# Altium project Wireless_Security_Board.PrjPcb (part 3 of 4)

## Sheet Microcontrollers.SchDoc
size A3; SheetNumber: 3; SheetTotal: 4
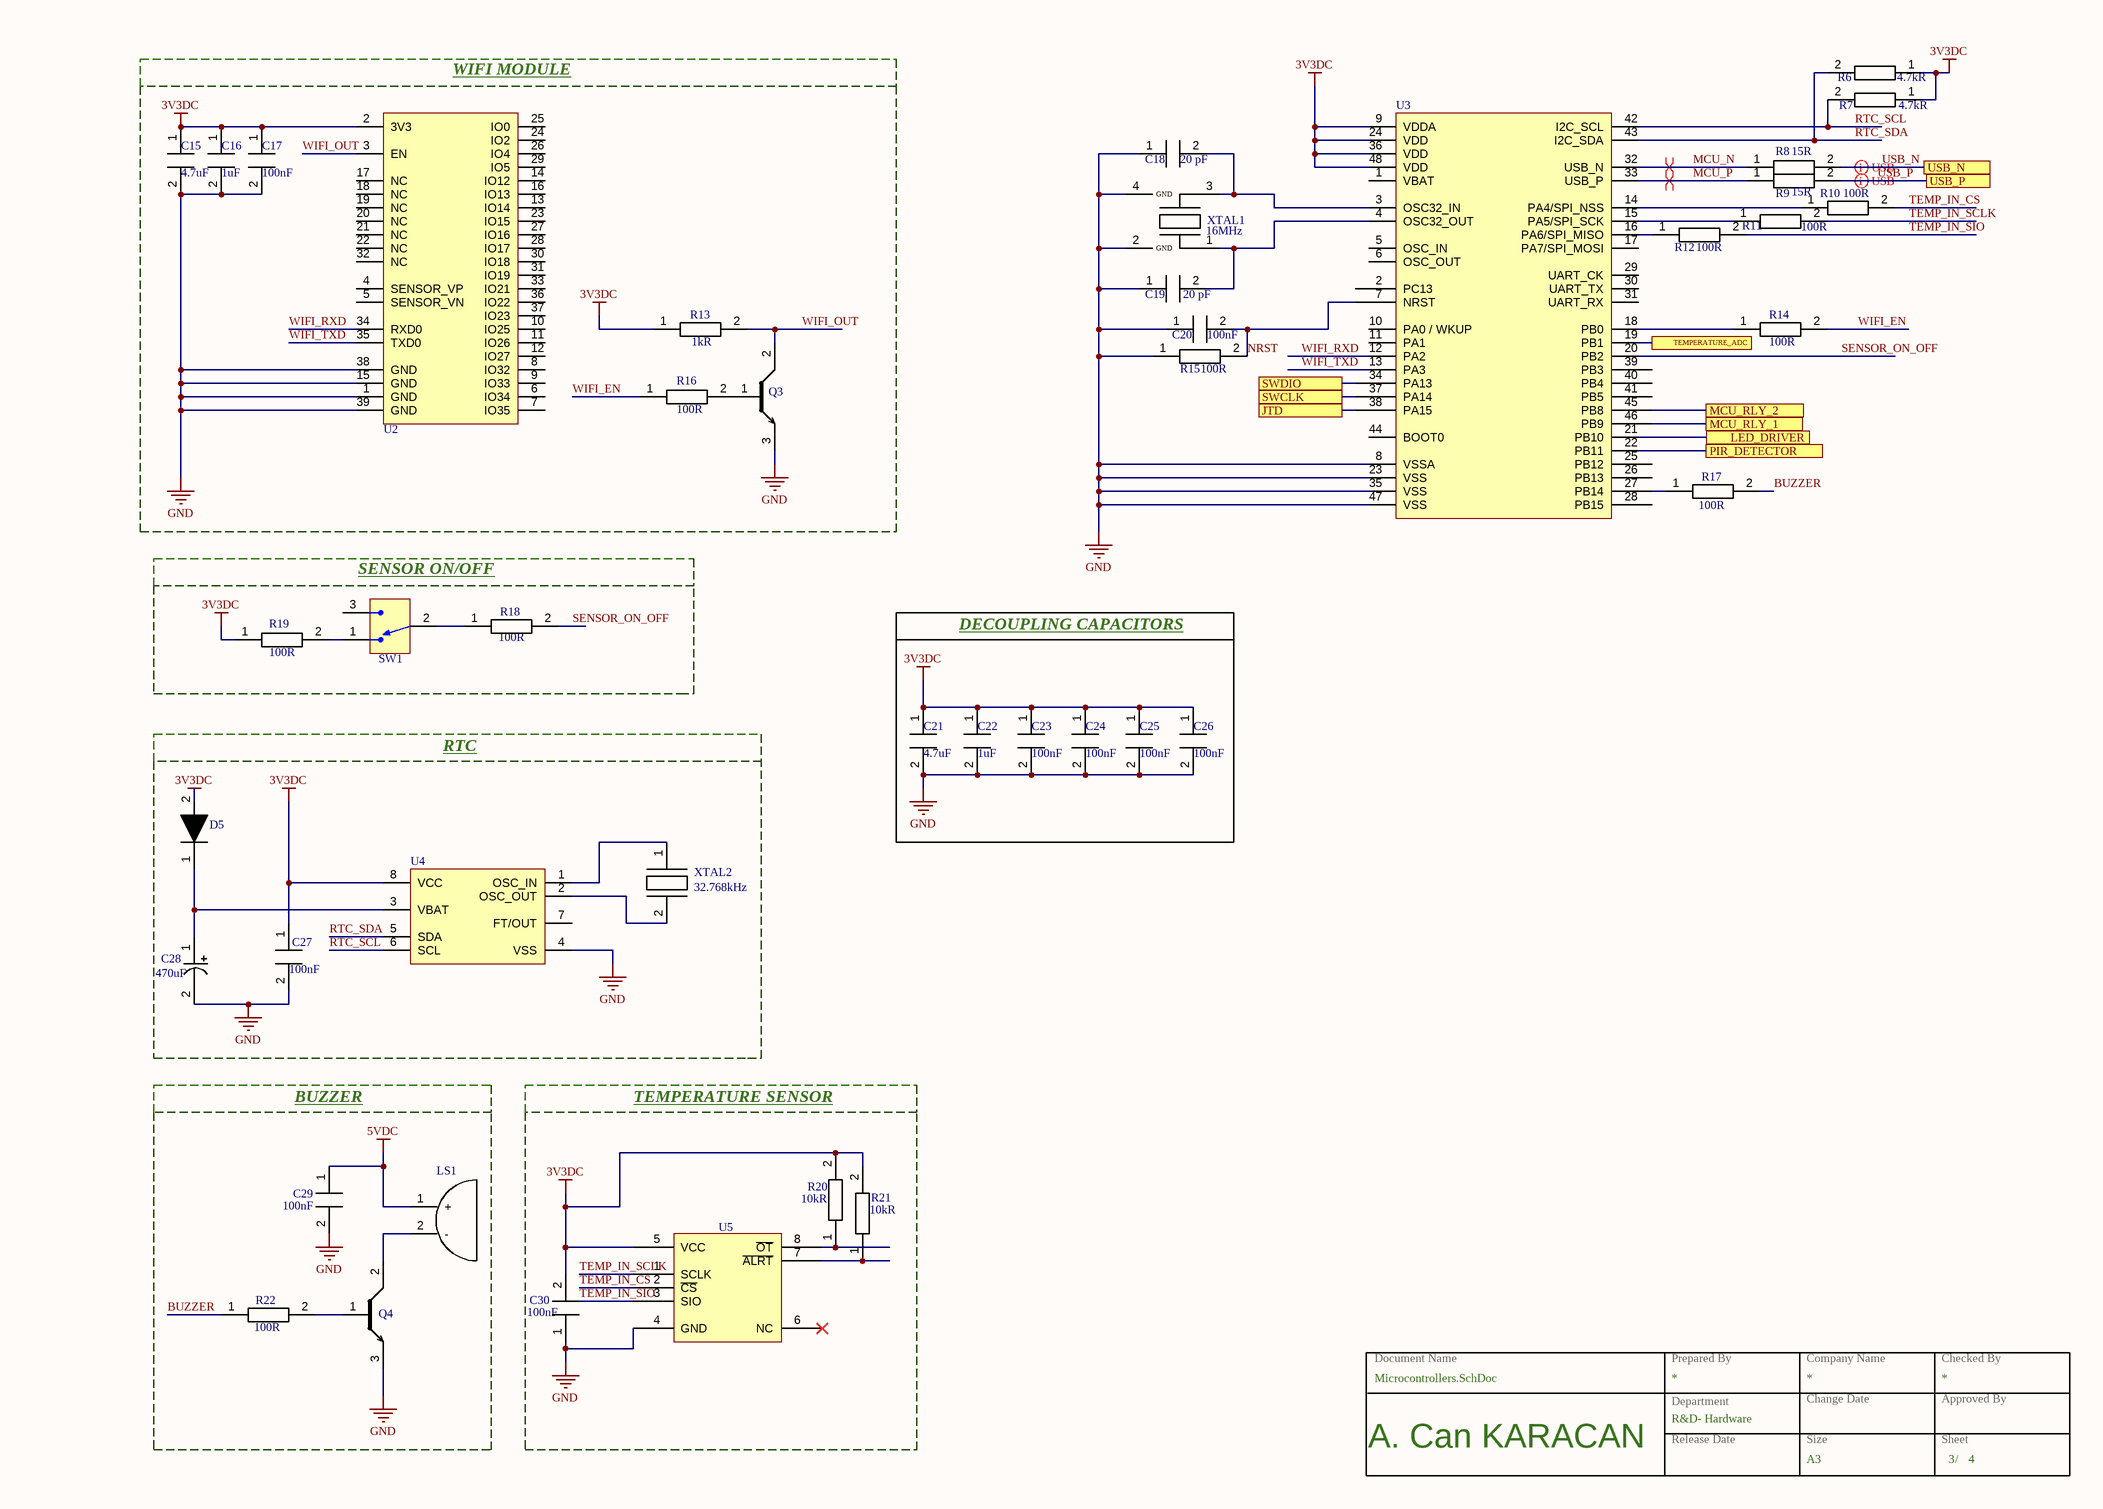
[diagram p3: Microcontrollers.SchDoc]

### Parts
C15  value 4.7uF  [CAP_0805]  (hidden comment: CL21A475KAQNNNE)
C16  value 1uF  [CAP_0805]  (hidden comment: CL21B105KBFNNNE)
C17  Capacitance: 100nF  [CAP_0805]  (hidden comment: CL21B104KBCNNNC)
C18  value 20 pF  [CAP_0603]  (hidden comment: CL10C200JB8NNNC)
C19  value 20 pF  [CAP_0603]
C20  Capacitance: 100nF  [CAP_0805]  (hidden comment: 104KBCNNNC)
C21  value 4.7uF  [CAP_0805]  (hidden comment: CL21A475KAQNNNE)
C22  value 1uF  [CAP_0805]  (hidden comment: CL21B105KBFNNNE)
C23  Capacitance: 100nF  [CAP_0805]  (hidden comment: CL21B104KBCNNNC)
C24  Capacitance: 100nF  [CAP_0805]  (hidden comment: CL21B104KBCNNNC)
C25  Capacitance: 100nF  [CAP_0805]  (hidden comment: CL21B104KBCNNNC)
C26  Capacitance: 100nF  [CAP_0805]  (hidden comment: CL21B104KBCNNNC)
C27  Capacitance: 100nF  [CAP_0805]  (hidden comment: CL21B104KBCNNNC)
C28  value 470uF  [CAP_RADIAL_D10_P5]  (hidden comment: ESH477M050AH4AA)
C29  Capacitance: 100nF  [CAP_0805]  (hidden comment: CL21B104KBCNNNC)
C30  Capacitance: 100nF  [CAP_0805]  (hidden comment: CL21B104KBCNNNC)
D5  1N4148WS  [SOD_323_F]  (value not drawn)
LS1  CMI-9605-0580T  [CMI-9605]  (value not drawn)
Q3  MMBT3904-7-F  [SOT_23_3]  (value not drawn)
Q4  MMBT3904-7-F  [SOT_23_3]  (value not drawn)
R6  value 4.7kR  [RE_0603]  (hidden comment: RC0603JR-074K7L)
R7  value 4.7kR  [RE_0603]  (hidden comment: RC0603JR-074K7L)
R8  value 15R  [RE_0603]  (hidden comment: RC0603JR-0715RL)
R9  value 15R  [RE_0603]  (hidden comment: RC0603JR-0715RL)
R10  value 100R  [RE_0603]  (hidden comment: RC0603JR-07100RL)
R11  value 100R  [RE_0603]  (hidden comment: RC0603JR-07100RL)
R12  value 100R  [RE_0603]  (hidden comment: RC0603JR-07100RL)
R13  value 1kR  [RE_0603]  (hidden comment: RC0402FR-071KL)
R14  value 100R  [RE_0603]  (hidden comment: RC0603JR-07100RL)
R15  value 100R  [RE_0603]  (hidden comment: RC0603JR-07100RL)
R16  value 100R  [RE_0603]  (hidden comment: RC0603JR-07100RL)
R17  value 100R  [RE_0603]  (hidden comment: RC0603JR-07100RL)
R18  value 100R  [RE_0603]  (hidden comment: RC0603JR-07100RL)
R19  value 100R  [RE_0603]  (hidden comment: RC0603JR-07100RL)
R20  value 10kR  [RE_0402]  (hidden comment: RC0402JR-0710KL)
R21  value 10kR  [RE_0402]  (hidden comment: RC0402JR-0710KL)
R22  value 100R  [RE_0603]  (hidden comment: RC0603JR-07100RL)
SW1  EG1215AA  [EG1215AA]  (value not drawn)
U2  ESP32-WROOM-32E-N4  [38_SMD]  (value not drawn)
U3  STM32F103C6T6A  [LQGP48-STM]  (value not drawn)
U4  M41T0M6F  [8_SOIC]  (value not drawn)
U5  MAX6662MSA+  [8_SOIC]  (value not drawn)
XTAL1  Frequency: 16MHz  [4-SMD, No Lead]  (hidden comment: ECS-160-20-30B-TR)
XTAL2  Frequency: 32.768kHz  [2-SMD, No Lead]  (hidden comment: ABS05-32.768KHZ-T)

### Blocks framed on the sheet
WIFI MODULE: C15-C17 Q3 R13 R16 U2
SENSOR ON/OFF: R18 R19 SW1
DECOUPLING CAPACITORS: C21-C26
RTC: C27 C28 D5 U4 XTAL2
BUZZER: C29 LS1 Q4 R22

### Ports
JTD (see Power_Management[5B]), LED_DRIVER (see Power_Management[4A]), MCU_RLY_1 (see Power_Management[4C]), MCU_RLY_2 (see Power_Management[3C]), PIR_DETECTOR (see Power_Management[4A]), SWCLK (see Power_Management[5B]), SWDIO (see Power_Management[5B]), TEMPERATURE_ADC (see Power_Management[4A]), USB_N (see Power_Management[5A]), USB_P (see Power_Management[5A])

### Nets
3V3DC: C15.1 C16.1 C17.1 C21.1 C22.1 C23.1 C24.1 C25.1 C26.1 C27.1 C30.2 D5.2 R6.1 R7.1 R13.1 R19.1 R20.2 R21.2 U2.2(3V3) U3.9(VDDA) U3.24(VDD) U3.36(VDD) U3.48(VDD) U4.8(VCC) U5.5(VCC)
5VDC: C29.1 LS1.1(+)
GND: C15.2 C16.2 C17.2 C18.1 C19.1 C20.1 C21.2 C22.2 C23.2 C24.2 C25.2 C26.2 C27.2 C28.2 C29.2 C30.1 Q3.3 Q4.3 R15.1 U2.1(GND) U2.15(GND) U2.38(GND) U2.39(GND) U3.8(VSSA) U3.23(VSS) U3.35(VSS) U3.47(VSS) U4.4(VSS) U5.4(GND) XTAL1.2(GND) XTAL1.4(GND)
BUZZER: R17.2 R22.1
MCU_N: R8.1 U3.32(USB_N)
MCU_P: R9.1 U3.33(USB_P)
NRST: C20.2 R15.2 U3.7(NRST)
RTC_SCL: R7.2 U3.42(I2C_SCL) U4.6(SCL)
RTC_SDA: R6.2 U3.43(I2C_SDA) U4.5(SDA)
SENSOR_ON_OFF: R18.2 U3.20(PB2)
TEMP_IN_CS: R10.2 U5.2(~{CS})
TEMP_IN_SCLK: R11.2 U5.1(SCLK)
TEMP_IN_SIO: R12.2 U5.3(SIO)
USB_N: R8.2 ; port USB_N
USB_P: R9.2 ; port USB_P
WIFI_EN: R14.2 R16.1
WIFI_OUT: Q3.2 R13.2 U2.3(EN)
WIFI_RXD: U2.34(RXD0) U3.12(PA2)
WIFI_TXD: U2.35(TXD0) U3.13(PA3)
NetC18_2: C18.2 U3.3(OSC32_IN) XTAL1.3
NetC19_2: C19.2 U3.4(OSC32_OUT) XTAL1.1
NetC28_1: C28.1 D5.1 U4.3(VBAT)
NetJ6_2: U3.34(PA13) ; port SWDIO
NetJ6_3: U3.37(PA14) ; port SWCLK
NetJ6_4: U3.38(PA15) ; port JTD
NetJ8_3: U3.22(PB11) ; port PIR_DETECTOR
NetJ8_4: U3.21(PB10) ; port LED_DRIVER
NetJ8_5: U3.19(PB1) ; port TEMPERATURE_ADC
NetLS1_2: LS1.2(-) Q4.2
NetQ3_1: Q3.1 R16.2
NetQ4_1: Q4.1 R22.2
NetR2_1: U3.46(PB9) ; port MCU_RLY_1
NetR3_1: U3.45(PB8) ; port MCU_RLY_2
NetR10_1: R10.1 U3.14(PA4/SPI_NSS)
NetR11_1: R11.1 U3.15(PA5/SPI_SCK)
NetR12_1: R12.1 U3.16(PA6/SPI_MISO)
NetR14_1: R14.1 U3.18(PB0)
NetR17_1: R17.1 U3.27(PB14)
NetR18_1: R18.1 SW1.2
NetR19_2: R19.2 SW1.1
NetR20_1: R20.1 U5.8(~{OT})
NetR21_1: R21.1 U5.7(~{ALRT})
NetU4_1: U4.1(OSC_IN) XTAL2.1
NetU4_2: U4.2(OSC_OUT) XTAL2.2

Not connected (* = marked no-connect by the designer): SW1 3; U2 4(SENSOR_VP) 5(SENSOR_VN) 6(IO34) 7(IO35) 8(IO32) 9(IO33) 10(IO25) 11(IO26) 12(IO27) 13(IO14) 14(IO12) 16(IO13) 17(NC) 18(NC) 19(NC) 20(NC) 21(NC) 22(NC) 23(IO15) 24(IO2) 25(IO0) 26(IO4) 27(IO16) 28(IO17) 29(IO5) 30(IO18) 31(IO19) 32(NC) 33(IO21) 36(IO22) 37(IO23); U3 1(VBAT) 2(PC13) 5(OSC_IN) 6(OSC_OUT) 10(PA0_/_WKUP) 11(PA1) 17(PA7/SPI_MOSI) 25(PB12) 26(PB13) 28(PB15) 29(UART_CK) 30(UART_TX) 31(UART_RX) 39(PB3) 40(PB4) 41(PB5) 44(BOOT0); U4 7(FT/OUT); U5 6(NC)*

### Layout directives
differential pair; differential pair class diff90: USB_N, USB_P
differential pair: MCU_N, MCU_P

### Notes on the sheet
- TEMPERATURE SENSOR
- Document Name
- Prepared By
- Company Name
- Checked By
- A. Can KARACAN
- Release Date
- Department
- R&D- Hardware
- Size
- Change Date
- A3
- Approved By
- Sheet
- /

### Library data of the parts
C15 C21 = CAP CER 4.7uF 0805: Multilayer Ceramic Capacitor, 4.7 uF, 25 V, ± 10%, X5R, 0805 [2012 Metric]; Manufacturer: Samsung; Material: 4241ConductorMaterial; Voltage Rating: 25V; Designed By: Ahmet Can; Supplier: Digi-Key; Supplier Part Number: 1276-1244-1-ND; Manufacturer Part Number: CL21A475KAQNNNE; RoHS: Yes; Category: Ceramic Capacitors; Stock: 3906800; Pricing: 1=0,1, 10=0,073, 50=0,0414, 100=0,0344, 500=0,02408, 1000=0,01994 (USD); Mounting Technology: Surface Mount; Case/Package: 0805; Case Code (Metric): 2012; Case Code (Imperial): 0805; Min Operating Temperature: -55°C; Max Operating Temperature: 85°C; Packaging: Tape and Reel; Tolerance: 10%; Dielectric: X5R; Voltage Rating (DC): 25V; Series: CL; Construction: Flat; Length: 2mm; Height: 1.25mm; Depth: 1.25mm; Radiation Hardening: No; Lead Free: Lead Free; RoHS Compliant: Yes; ComponentLink1URL: https://datasheet.ciiva.com/25798/cl21a475kaqnnne-25798882.pdf?src-supplier=Digi-Key; ComponentLink1Description: https://datasheet.ciiva.com/25798/cl21a475kaqnnne-25798882.pdf?src-supplier=Digi-Key
C16 C22 = CAP CER 1uF 0805: CAP CER %10 1uF 0805; Manufacturer: Samsung; Material: 4241ConductorMaterial; Tolerance: 10%; Voltage Rating: 50V; Dielectric: X7R; Supplier: Digi-Key; Supplier Part Number: 1276-1029-1-ND; Manufacturer Part Number: CL21B105KBFNNNE; RoHS: Yes; Category: Ceramic Capacitors; Stock: 212507; Pricing: 1=0,11, 10=0,079, 50=0,045, 100=0,0373, 500=0,02616, 1000=0,02165 (USD); Mounting Technology: Surface Mount; Case/Package: 0805; Case Code (Metric): 2012; Case Code (Imperial): 0805; Min Operating Temperature: -55°C; Max Operating Temperature: 125°C; Packaging: Tape and Reel; Package Quantity: 1; Voltage: 50V; Series: CL; Construction: Flat; Voltage Rating (DC): 50V; Length: 2mm; Width: 0.049inch; Height: 1.25mm; Thickness: 0.053inch; Depth: 1.25mm; Radiation Hardening: No; RoHS Compliant: Yes; ComponentLink1URL: https://datasheet.ciiva.com/25800/cl21b105kbfnnne-25800291.pdf?src-supplier=Digi-Key; ComponentLink1Description: https://datasheet.ciiva.com/25800/cl21b105kbfnnne-25800291.pdf?src-supplier=Digi-Key; ComponentLink2URL: https://datasheet.ciiva.com/16449/cl21b105kbfnnne-16449003.pdf?src-supplier=Future+Electronics; ComponentLink2Description: https://datasheet.ciiva.com/16449/cl21b105kbfnnne-16449003.pdf?src-supplier=Future+Electronics
C17 C23-C26 = CAP CER 100nF 0805: Multilayer Ceramic Capacitor, 0.1 uF, 50 V, ± 10%, X7R, 0805 [2012 Metric]; Manufacturer: Samsung; Voltage Rating: 50V; Supplier: Digi-Key; Supplier Part Number: 1276-1003-1-ND; Manufacturer Part Number: CL21B104KBCNNNC; RoHS: Yes; Category: Ceramic Capacitors; Stock: 1461740; Pricing: 1=0,1, 10=0,044, 50=0,024, 100=0,0196, 500=0,01404, 1000=0,01103 (USD); Mounting Technology: Surface Mount; Case/Package: 0805; Case Code (Metric): 2012; Case Code (Imperial): 0805; Material: Ceramic; Min Operating Temperature: -55°C; Max Operating Temperature: 125°C; Tolerance: 10%; Dielectric: X7R; Packaging: Tape and Reel; Voltage: 50V; Voltage Rating (DC): 50V; Series: CL; Construction: Flat; Length: 2mm; Width: 0.049inch; Height: 0.85mm; Depth: 1.25mm; Thickness: 0.037inch; Radiation Hardening: No; Lead Free: Lead Free; RoHS Compliant: Yes; ComponentLink1URL: https://datasheet.ciiva.com/25710/cl21b104kbcnnnc-25710182.pdf?src-supplier=Digi-Key; ComponentLink1Description: https://datasheet.ciiva.com/25710/cl21b104kbcnnnc-25710182.pdf?src-supplier=Digi-Key; ComponentLink2URL: https://datasheet.ciiva.com/29199/454152-da-01-en-vs-kondensator-0805-29199814.pdf?src-supplier=Conrad; ComponentLink2Description: https://datasheet.ciiva.com/29199/454152-da-01-en-vs-kondensator-0805-29199814.pdf?src-supplier=Conrad
C18 = CAP CER 20pF 0603: CAP CER 20PF 50V C0G/NP0 0603; Manufacturer: Samsung; Dielectric: C0G, NP0; Tolerance: ±5%; Designed By: Ahmet Can; Supplier: Digi-Key; Supplier Part Number: 1276-1187-1-ND; Manufacturer Part Number: CL10C200JB8NNNC; RoHS: Yes; Category: Ceramic Capacitors; Stock: 415846; Pricing: 1=0,1, 10=0,044, 50=0,0238, 100=0,0194, 500=0,01386, 1000=0,01089 (USD); ComponentLink1URL: https://datasheet.ciiva.com/26877/getdatasheetpartid-640634-26877974.pdf?src-supplier=Verical; ComponentLink1Description: https://datasheet.ciiva.com/26877/getdatasheetpartid-640634-26877974.pdf?src-supplier=Verical; ComponentLink2URL: https://datasheet.ciiva.com/26310/mlcc-catalogdownload2013-eng-26310315.pdf?src-supplier=Distrelec; ComponentLink2Description: https://datasheet.ciiva.com/26310/mlcc-catalogdownload2013-eng-26310315.pdf?src-supplier=Distrelec; Voltage Rating: 50V; Mounting Type: Surface Mount; Max Operating Temperature: 125°C; Min Operating Temperature: -55°C; Case/Package: 0603
C19 = CAP CER 20pF 0603: CAP CER 20PF 50V C0G/NP0 0603; Manufacturer: Samsung; Manufacturer Part Number: CL10C200JB8NNNC; Dielectric: C0G, NP0; Tolerance: ±5%; Designed By: Ahmet Can; Supplier: Digi-Key; Supplier Part Number: 1276-1187-1-ND; RoHS: Yes; Category: Ceramic Capacitors; Stock: 415846; Pricing: 1=0,1, 10=0,044, 50=0,0238, 100=0,0194, 500=0,01386, 1000=0,01089 (USD); ComponentLink1URL: https://datasheet.ciiva.com/26877/getdatasheetpartid-640634-26877974.pdf?src-supplier=Verical; ComponentLink1Description: https://datasheet.ciiva.com/26877/getdatasheetpartid-640634-26877974.pdf?src-supplier=Verical; ComponentLink2URL: https://datasheet.ciiva.com/26310/mlcc-catalogdownload2013-eng-26310315.pdf?src-supplier=Distrelec; ComponentLink2Description: https://datasheet.ciiva.com/26310/mlcc-catalogdownload2013-eng-26310315.pdf?src-supplier=Distrelec; Voltage Rating: 50V; Mounting Type: Surface Mount; Max Operating Temperature: 125°C; Min Operating Temperature: -55°C; Case/Package: 0603
C20 = CAP CER 100nF 0805: Multilayer Ceramic Capacitor, 0.1 uF, 50 V, ± 10%, X7R, 0805 [2012 Metric]; Manufacturer: Samsung; Manufacturer Part Number: CL21B104KBCNNNC; Voltage Rating: 50V; Supplier: Digi-Key; Supplier Part Number: 1276-1003-1-ND; RoHS: Yes; Category: Ceramic Capacitors; Stock: 1461740; Pricing: 1=0,1, 10=0,044, 50=0,024, 100=0,0196, 500=0,01404, 1000=0,01103 (USD); Mounting Technology: Surface Mount; Case/Package: 0805; Case Code (Metric): 2012; Case Code (Imperial): 0805; Material: Ceramic; Min Operating Temperature: -55°C; Max Operating Temperature: 125°C; Tolerance: 10%; Dielectric: X7R; Packaging: Tape and Reel; Voltage: 50V; Voltage Rating (DC): 50V; Series: CL; Construction: Flat; Length: 2mm; Width: 0.049inch; Height: 0.85mm; Depth: 1.25mm; Thickness: 0.037inch; Radiation Hardening: No; Lead Free: Lead Free; RoHS Compliant: Yes; ComponentLink1URL: https://datasheet.ciiva.com/25710/cl21b104kbcnnnc-25710182.pdf?src-supplier=Digi-Key; ComponentLink1Description: https://datasheet.ciiva.com/25710/cl21b104kbcnnnc-25710182.pdf?src-supplier=Digi-Key; ComponentLink2URL: https://datasheet.ciiva.com/29199/454152-da-01-en-vs-kondensator-0805-29199814.pdf?src-supplier=Conrad; ComponentLink2Description: https://datasheet.ciiva.com/29199/454152-da-01-en-vs-kondensator-0805-29199814.pdf?src-supplier=Conrad
C27 C29 C30 = CAP CER 100nF 0805: Multilayer Ceramic Capacitor, 0.1 uF, 50 V, ± 10%, X7R, 0805 [2012 Metric]; Manufacturer: Samsung; Voltage Rating: 50V; Designed By: Ahmet Can; Supplier: Digi-Key; Supplier Part Number: 1276-1003-1-ND; Manufacturer Part Number: CL21B104KBCNNNC; RoHS: Yes; Category: Ceramic Capacitors; Stock: 1461740; Pricing: 1=0,1, 10=0,044, 50=0,024, 100=0,0196, 500=0,01404, 1000=0,01103 (USD); Mounting Technology: Surface Mount; Case/Package: 0805; Case Code (Metric): 2012; Case Code (Imperial): 0805; Material: Ceramic; Min Operating Temperature: -55°C; Max Operating Temperature: 125°C; Tolerance: 10%; Dielectric: X7R; Packaging: Tape and Reel; Voltage: 50V; Voltage Rating (DC): 50V; Series: CL; Construction: Flat; Length: 2mm; Width: 0.049inch; Height: 0.85mm; Depth: 1.25mm; Thickness: 0.037inch; Radiation Hardening: No; Lead Free: Lead Free; RoHS Compliant: Yes; ComponentLink1URL: https://datasheet.ciiva.com/25710/cl21b104kbcnnnc-25710182.pdf?src-supplier=Digi-Key; ComponentLink1Description: https://datasheet.ciiva.com/25710/cl21b104kbcnnnc-25710182.pdf?src-supplier=Digi-Key; ComponentLink2URL: https://datasheet.ciiva.com/29199/454152-da-01-en-vs-kondensator-0805-29199814.pdf?src-supplier=Conrad; ComponentLink2Description: https://datasheet.ciiva.com/29199/454152-da-01-en-vs-kondensator-0805-29199814.pdf?src-supplier=Conrad
C28 = CAP ALU ELEC 470uF: Cap, 470UF, 50V, Alu Elec, Radial, Through Hole; Manufacturer: KEMET; Designed By: Ahmet Can; Lifetime @ Temp.: 2000 Hrs @ 105°C; Ripple Current @ Low Frequency: 630 mA @ 120 Hz; Ripple Current @ High Frequency: 945 mA @ 10 kHz; Polarization: Polar; Tolerance: ±20%; Supplier: Digi-Key; Supplier Part Number: 399-15683-ND; Manufacturer Part Number: ESH477M050AH4AA; RoHS: Yes; Stock: 6383; Pricing: 1=0,64, 10=0,455, 50=0,344, 100=0,2997, 500=0,222, 1000=0,1887, 2500=0,1776, 5000=0,1665 (USD); ComponentLink1URL: https://api.kemet.com/component-edge/download/datasheet/ESH477M050AH4AA.pdf?src-supplier=Digi-Key; ComponentLink1Description: https://api.kemet.com/component-edge/download/datasheet/ESH477M050AH4AA.pdf?src-supplier=Digi-Key; ComponentLink2URL: https://datasheet.octopart.com/ESH477M050AH4AA-KEMET-datasheet-130075338.pdf?src-supplier=Newark; ComponentLink2Description: https://datasheet.octopart.com/ESH477M050AH4AA-KEMET-datasheet-130075338.pdf?src-supplier=Newark; Category: Aluminum Electrolytic Capacitors; Case/Package: TH, Radial, Can; Mounting Type: Through Hole; Voltage Rating: 50V; Min Operating Temperature: -40°C; Max Operating Temperature: 105°C
D5 = DIO_1N4148WS: Diode Ultra Fast Recovery Rectifier 75V 0.15A 2-Pin SOD-323F T/R; Manufacturer: ON Semiconductor / Fairchild; Forward Current: 150mA; Max Forward Surge Current (Ifsm): 2A; Max Reverse Current: 5uA; Reverse Recovery Time: 4ns; Element Configuration: Single; Designed By: Ahmet Can; Supplier: Digi-Key; Supplier Part Number: 1N4148WSFSCT-ND; Manufacturer Part Number: 1N4148WS; RoHS: Yes; Category: Rectifier Diodes; Stock: 1299120; Pricing: 1=0,17, 10=0,159, 100=0,0867, 500=0,05332, 1000=0,03636 (USD); Mounting Technology: Surface Mount; Pins: 2; Weight: 0.0276g; Min Operating Temperature: -55°C; Max Operating Temperature: 150°C; Packaging: Tape and Reel; Max Repetitive Reverse Voltage (Vrrm): 75V; Average Rectified Current: 150mA; Max Reverse Voltage (DC): 75V; Series: -; Package Quantity: 1; Recovery Time: 4ns; Reverse Voltage: 75V; Length: 1.8mm; Width: 1.35mm; Height: 1mm; Radiation Hardening: No; RoHS Compliant: Yes; Reach SVHC Compliant: No; Lead Free: Lead Free; ComponentLink1URL: https://datasheet.ciiva.com/15208/getdatasheetpartid-127819-15208358.pdf?src-supplier=Verical; ComponentLink1Description: https://datasheet.ciiva.com/15208/getdatasheetpartid-127819-15208358.pdf?src-supplier=Verical; ComponentLink2URL: https://datasheet.ciiva.com/8300/1n914bws-8300360.pdf?src-supplier=Avnet; ComponentLink2Description: https://datasheet.ciiva.com/8300/1n914bws-8300360.pdf?src-supplier=Avnet; ComponentLink3URL: https://datasheet.ciiva.com/910/1n4148ws-910381.pdf?src-supplier=Digi-Key; ComponentLink3Description: https://datasheet.ciiva.com/910/1n4148ws-910381.pdf?src-supplier=Digi-Key; ComponentLink4URL: https://datasheet.ciiva.com/910/1n4148ws-910382.pdf?src-supplier=Digi-Key; ComponentLink4Description: https://datasheet.ciiva.com/910/1n4148ws-910382.pdf?src-supplier=Digi-Key
LS1 = LS_CMI-9605-0580T: 9.6 mm, 5 Vdc, 80 dB, Through Hole, Driving Circuit, Magnetic Audio Indicator Buzzer; Manufacturer: CUI; Designed By: Ahmet Can; Min Supply Voltage: 3V; Max Supply Voltage: 7V; SPL: 80dB @ 5V, 10cm; Nominal Supply Voltage: 5V; Frequency: 2.7kHz; Supply Current: 30mA; Supplier: Digi-Key; Supplier Part Number: 102-CMI-9605-0580T-ND; Manufacturer Part Number: CMI-9605-0580T; RoHS: No; Max Operating Temperature: 70°C; Min Operating Temperature: -30°C; Mounting Technology: Through Hole; Packaging: Box; Case/Package: CMI-9605; Voltage Rating: 5V
Q3 Q4 = Q_MMBT3904-7-F: Transistor General Purpose BJT NPN 40 Volt 0.2A Automotive 3-Pin SOT-23-3; Manufacturer: Diodes Zetex; Max Power Dissipation: 300mW; Collector Emitter Voltage (VCEO): 40V; Max Collector Current: 200mA; Collector Base Voltage (VCBO): 60V; Power Dissipation: 350mW; Frequency: 300MHz; hFE Min: 100; Number of Elements: 1; Emitter Base Voltage (VEBO): 6V; Collector Emitter Saturation Voltage: 300mV; Designed By: Ahmet Can; Supplier: Digi-Key; Supplier Part Number: MMBT3904-FDICT-ND; Manufacturer Part Number: MMBT3904-7-F; RoHS: Yes; Category: BJTs; Stock: 5948624; Pricing: 1=0,12, 10=0,111, 100=0,0607, 500=0,03732, 1000=0,02545 (USD); Mounting Technology: Surface Mount; Case/Package: SOT-23; Pins: 3; Weight: 0.000282oz; Min Operating Temperature: -55°C; Max Operating Temperature: 150°C; Polarity: NPN; Packaging: Tape and Reel; Voltage Rating (DC): 40V; Package Quantity: 3000; Transition Frequency: 300MHz; Collector Emitter Breakdown Voltage: 40V; Max Breakdown Voltage: 40V; Continuous Collector Current: 200mA; Clock Frequency: 300MHz; Gain Bandwidth Product: 300MHz; Series: Automotive, AEC-Q101; Collector-emitter Voltage-Max: 300mV; Length: 3.05mm; Width: 1.4mm; Height: 1mm; Radiation Hardening: No; Reach SVHC Compliant: No; Lead Free: Lead Free; RoHS Compliant: Yes; ComponentLink1URL: https://datasheet.ciiva.com/11201/ds30036-11201778.pdf?src-supplier=Avnet; ComponentLink1Description: https://datasheet.ciiva.com/11201/ds30036-11201778.pdf?src-supplier=Avnet; ComponentLink2URL: https://datasheet.ciiva.com/15138/getdatasheetpartid-53265-15138780.pdf?src-supplier=Verical; ComponentLink2Description: https://datasheet.ciiva.com/15138/getdatasheetpartid-53265-15138780.pdf?src-supplier=Verical; ComponentLink3URL: https://datasheet.ciiva.com/22711/1915516-22711750.pdf?src-supplier=Element14; ComponentLink3Description: https://datasheet.ciiva.com/22711/1915516-22711750.pdf?src-supplier=Element14; ComponentLink4URL: https://datasheet.ciiva.com/11198/ds30036-11198999.pdf?src-supplier=Avnet; ComponentLink4Description: https://datasheet.ciiva.com/11198/ds30036-11198999.pdf?src-supplier=Avnet; ComponentLink5URL: https://datasheet.ciiva.com/6361/ds30036-6361256.pdf?src-supplier=Digi-Key; ComponentLink5Description: https://datasheet.ciiva.com/6361/ds30036-6361256.pdf?src-supplier=Digi-Key; ComponentLink6URL: https://datasheet.ciiva.com/6361/ds30036-6361254.pdf?src-supplier=Digi-Key; ComponentLink6Description: https://datasheet.ciiva.com/6361/ds30036-6361254.pdf?src-supplier=Digi-Key
R6 R7 = RES 4K7 0603: SMD Chip Resistor, 4.7 kOhm, ± 5%, 100 mW, 0603 [1608 Metric], Thick Film, General Purpose; Manufacturer: Yageo; Voltage Rating (DC): 50V; Temperature Coefficient: 100ppm/°C; Power Rating: 100mW; Designed By: Ahmet Can; Supplier: Digi-Key; Supplier Part Number: 311-4.7KGRCT-ND; Manufacturer Part Number: RC0603JR-074K7L; RoHS: Yes; Category: Chip SMD Resistors; Stock: 7017381; Pricing: 1=0,1, 10=0,014, 50=0,0088, 100=0,0073, 500=0,00486, 1000=0,00415 (USD); Case/Package: 0603; Pins: 2; Case Code (Imperial): 0603; Case Code (Metric): 1608; Min Operating Temperature: -55°C; Max Operating Temperature: 155°C; Resistor Type: Thick Film; Tolerance: 5%; Packaging: Tape and Reel; Voltage Rating: 50V; Termination: SMD/SMT; Features: Moisture Resistant; Max Power Dissipation: 100mW; Number of Terminations: 2; Series: RC; Resistance Tolerance: 5%; Construction: Rectangular; Voltage Rating (AC): 50V; Length: 1.6mm; Width: 0.8mm; Depth: 0.8mm; Reach SVHC Compliant: No; Lead Free: Lead Free; RoHS Compliant: Yes; Military Standard: Not; ComponentLink1URL: https://datasheet.ciiva.com/46412/443971-46412858.pdf?src-supplier=Element14; ComponentLink1Description: https://datasheet.ciiva.com/46412/443971-46412858.pdf?src-supplier=Element14
R8 R9 = RES 15 0603: SMD Chip Resistor, 15 Ohm, ± 5%, 100 mW, 0603 [1608 Metric], Thick Film, General Purpose; Manufacturer: Yageo; Temperature Coefficient: ±100ppm/°C; Designed By: Ahmet Can; Supplier: Digi-Key; Supplier Part Number: 311-15GRCT-ND; Manufacturer Part Number: RC0603JR-0715RL; RoHS: Yes; Category: Chip SMD Resistors; Stock: 973740; Pricing: 1=0,1, 10=0,014, 50=0,0088, 100=0,0073, 500=0,00486, 1000=0,00415 (USD); ComponentLink1URL: https://datasheet.ciiva.com/7746/443971-7746445.pdf?src-supplier=Element14; ComponentLink1Description: https://datasheet.ciiva.com/7746/443971-7746445.pdf?src-supplier=Element14; ComponentLink2URL: https://datasheet.ciiva.com/7746/443971-7746446.pdf?src-supplier=Element14; ComponentLink2Description: https://datasheet.ciiva.com/7746/443971-7746446.pdf?src-supplier=Element14; ComponentLink3URL: https://datasheet.ciiva.com/2453/pyu-r-int-thick-7-2453085.pdf?src-supplier=Digi-Key; ComponentLink3Description: https://datasheet.ciiva.com/2453/pyu-r-int-thick-7-2453085.pdf?src-supplier=Digi-Key; ComponentLink4URL: https://datasheet.ciiva.com/2453/pyu-r-int-thick-7-2453086.pdf?src-supplier=Digi-Key; ComponentLink4Description: https://datasheet.ciiva.com/2453/pyu-r-int-thick-7-2453086.pdf?src-supplier=Digi-Key; ComponentLink5URL: https://datasheet.ciiva.com/2453/pyu-r-int-thick-7-2453087.pdf?src-supplier=Digi-Key; ComponentLink5Description: https://datasheet.ciiva.com/2453/pyu-r-int-thick-7-2453087.pdf?src-supplier=Digi-Key; Tolerance: ± 5%; Composition: Thick Film; Features: Moisture Resistant; Case/Package: 0603
R10-R12 R14-R19 R22 = RES 100 0603: Res Thick Film 0603 100 Ohm 5% 1/10W ±100ppm/°C Molded SMD SMD Paper T/R; Manufacturer: Yageo; Voltage Rating (DC): 50V; Power Rating: 100mW; Designed By: Ahmet Can; Supplier: Digi-Key; Supplier Part Number: 311-100GRCT-ND; Manufacturer Part Number: RC0603JR-07100RL; RoHS: Yes; Category: Chip SMD Resistors; Stock: 909469; Pricing: 1=0,1, 10=0,014, 50=0,0088, 100=0,0073, 500=0,00486, 1000=0,00415 (USD); Case/Package: 0603; Pins: 2; Contact Plating: Tin,Matte; Case Code (Imperial): 0603; Case Code (Metric): 1608; Min Operating Temperature: -55°C; Max Operating Temperature: 155°C; Tolerance: 5%; Temperature Coefficient: 100ppm/°C; Resistor Type: Thick Film; Packaging: Tape and Reel; Voltage Rating: 50V; Termination: SMD/SMT; Features: Moisture Resistant; Series: RC; Max Power Dissipation: 100mW; Number of Terminations: 2; Construction: Rectangular; Resistance Tolerance: 5%; Length: 1.6mm; Width: 0.8mm; Depth: 0.8mm; Lead Free: Lead Free; Reach SVHC Compliant: Unknown; Military Standard: Not; RoHS Compliant: Yes; ComponentLink1URL: https://datasheet.ciiva.com/7746/443971-7746425.pdf?src-supplier=Element14; ComponentLink1Description: https://datasheet.ciiva.com/7746/443971-7746425.pdf?src-supplier=Element14; ComponentLink2URL: https://datasheet.ciiva.com/7746/443971-7746426.pdf?src-supplier=Element14; ComponentLink2Description: https://datasheet.ciiva.com/7746/443971-7746426.pdf?src-supplier=Element14; ComponentLink3URL: https://datasheet.ciiva.com/8883/pyu-rc0603-51-rohs-l-4-8883047.pdf?src-supplier=Avnet; ComponentLink3Description: https://datasheet.ciiva.com/8883/pyu-rc0603-51-rohs-l-4-8883047.pdf?src-supplier=Avnet; ComponentLink4URL: https://datasheet.ciiva.com/15189/getdatasheetpartid-325207-15189846.pdf?src-supplier=Verical; ComponentLink4Description: https://datasheet.ciiva.com/15189/getdatasheetpartid-325207-15189846.pdf?src-supplier=Verical
R13 = RES 1K 0603: SMD Chip Resistor, 1 kOhm, ± 1%, 63 mW, 0402 [1005 Metric], Thick Film, General Purpose; Manufacturer: Yageo; Temperature Coefficient: 100ppm/°C; Voltage Rating (DC): 50V; Power Rating: 62.5mW; Max Power Dissipation: 63mW; Designed By: Ahmet Can; ComponentLink6URL: https://datasheet.ciiva.com/15189/getdatasheetpartid-409289-15189591.pdf?src-supplier=Verical; ComponentLink6Description: https://datasheet.ciiva.com/15189/getdatasheetpartid-409289-15189591.pdf?src-supplier=Verical; Supplier: Digi-Key; Supplier Part Number: 311-1.00KLRCT-ND; Manufacturer Part Number: RC0402FR-071KL; RoHS: Yes; Category: Chip SMD Resistors; Stock: 23618166; Pricing: 1=0,1, 10=0,014, 50=0,0084, 100=0,007, 500=0,00464, 1000=0,00396, 5000=0,00282 (USD); Case/Package: 0402; Pins: 2; Case Code (Imperial): 0402; Case Code (Metric): 1005; Min Operating Temperature: -55°C; Max Operating Temperature: 155°C; Resistor Type: Thick Film; Tolerance: 1%; Packaging: Tape and Reel; Voltage Rating: 50V; Termination: SMD/SMT; Features: Moisture Resistant; Series: RC; Number of Terminations: 2; Resistance Tolerance: 1%; Construction: Rectangular; Technology: THICK FILM; Voltage Rating (AC): 50V; Length: 1mm; Width: 0.5mm; Height: 0.32mm; Depth: 0.5mm; Reach SVHC Compliant: No; Lead Free: Lead Free; RoHS Compliant: Yes; Military Standard: Not; ComponentLink1URL: https://datasheet.ciiva.com/11819/0900766b80c66297-11819477.pdf?src-supplier=Rs; ComponentLink1Description: https://datasheet.ciiva.com/11819/0900766b80c66297-11819477.pdf?src-supplier=Rs; ComponentLink2URL: https://datasheet.ciiva.com/7983/1018594-7983502.pdf?src-supplier=Element14; ComponentLink2Description: https://datasheet.ciiva.com/7983/1018594-7983502.pdf?src-supplier=Element14; ComponentLink3URL: https://datasheet.ciiva.com/22747/1018594-22747513.pdf?src-supplier=Element14; ComponentLink3Description: https://datasheet.ciiva.com/22747/1018594-22747513.pdf?src-supplier=Element14; ComponentLink4URL: https://datasheet.ciiva.com/12666/pyu-rc0402-51-rohs-l-6-r-12666741.pdf?src-supplier=Mouser; ComponentLink4Description: https://datasheet.ciiva.com/12666/pyu-rc0402-51-rohs-l-6-r-12666741.pdf?src-supplier=Mouser; ComponentLink5URL: https://datasheet.ciiva.com/7849/1018594-7849869.pdf?src-supplier=Element14; ComponentLink5Description: https://datasheet.ciiva.com/7849/1018594-7849869.pdf?src-supplier=Element14; ComponentLink7URL: https://datasheet.ciiva.com/7849/1018594-7849871.pdf?src-supplier=Element14; ComponentLink7Description: https://datasheet.ciiva.com/7849/1018594-7849871.pdf?src-supplier=Element14; ComponentLink8URL: https://datasheet.ciiva.com/17063/pyu-rc0402-51-rohs-l-6-r-17063193.pdf?src-supplier=Future+Electronics; ComponentLink8Description: https://datasheet.ciiva.com/17063/pyu-rc0402-51-rohs-l-6-r-17063193.pdf?src-supplier=Future+Electronics
R20 R21 = RES 10K 0402: SMD Chip Resistor, 10 kOhm, ± 5%, 63 mW, 0402 [1005 Metric], Thick Film, General Purpose; Manufacturer: Yageo; Temperature Coefficient: 100ppm/°C; Power Rating: 62.5mW; Voltage Rating: 50V; Max Power Dissipation: 63mW; Designed By: Ahmet Can; Supplier: Digi-Key; Supplier Part Number: 311-10KJRCT-ND; Manufacturer Part Number: RC0402JR-0710KL; RoHS: Yes; Category: Chip SMD Resistors; Stock: 36586137; Pricing: 1=0,1, 10=0,018, 50=0,0098, 100=0,0079, 500=0,00502, 1000=0,00422, 5000=0,00292 (USD); Case/Package: 0402; Case Code (Metric): 1005; Case Code (Imperial): 0402; Min Operating Temperature: -55°C; Max Operating Temperature: 155°C; Tolerance: 5%; Packaging: Tape and Reel; Package Quantity: 1; Resistor Type: Thick Film; Number of Terminations: 2; Termination: SMD/SMT; Features: Moisture Resistant; Series: RC; Resistance Tolerance: 5%; Construction: Rectangular; Voltage Rating (AC): 50V; Length: 0.039inch; Width: 0.02inch; Height: 0.016inch; Depth: 0.5mm; RoHS Compliant: Yes; Military Standard: Not; Lead Free: Lead Free; Reach SVHC Compliant: Unknown; ComponentLink1URL: https://datasheet.ciiva.com/2452/pyu-r-int-thick-7-2452627.pdf?src-supplier=Digi-Key; ComponentLink1Description: https://datasheet.ciiva.com/2452/pyu-r-int-thick-7-2452627.pdf?src-supplier=Digi-Key; ComponentLink2URL: https://datasheet.ciiva.com/2452/pyu-r-int-thick-7-2452628.pdf?src-supplier=Digi-Key; ComponentLink2Description: https://datasheet.ciiva.com/2452/pyu-r-int-thick-7-2452628.pdf?src-supplier=Digi-Key; ComponentLink3URL: https://datasheet.ciiva.com/2452/pyu-r-int-thick-7-2452626.pdf?src-supplier=Digi-Key; ComponentLink3Description: https://datasheet.ciiva.com/2452/pyu-r-int-thick-7-2452626.pdf?src-supplier=Digi-Key; ComponentLink4URL: https://datasheet.ciiva.com/12669/pyu-rc0402-51-rohs-l-6-r-12669687.pdf?src-supplier=Mouser; ComponentLink4Description: https://datasheet.ciiva.com/12669/pyu-rc0402-51-rohs-l-6-r-12669687.pdf?src-supplier=Mouser; ComponentLink5URL: https://datasheet.ciiva.com/7850/1018594-7850136.pdf?src-supplier=Element14; ComponentLink5Description: https://datasheet.ciiva.com/7850/1018594-7850136.pdf?src-supplier=Element14; ComponentLink6URL: https://datasheet.ciiva.com/7850/1018594-7850137.pdf?src-supplier=Element14; ComponentLink6Description: https://datasheet.ciiva.com/7850/1018594-7850137.pdf?src-supplier=Element14
SW1 = SW_EG1215AA: Slide Switch, SPDT, 0.025A, 24V, SMD; Manufacturer: E-Switch; Mechanical Life: 10000Cycles; Switch Function: On-On; Actuator Type: Standard; Switch Travel: 1.5mm; Operating Force: 150gf; Actuator Length: 1.4mm; Designed By: Ahmet Can; Supplier: Digi-Key; Supplier Part Number: EG5720CT-ND; Manufacturer Part Number: EG1215AA; RoHS: Yes; Stock: 17783; Pricing: 1=0,99, 10=0,951, 25=0,8884, 100=0,7715, 250=0,702, 500=0,6508, 1000=0,60327 (USD); Mounting Technology: Surface Mount; Min Operating Temperature: -20°C; Max Operating Temperature: 70°C; Throw Configuration: SPDT; Packaging: Cut Tape; Voltage Rating (DC): 24V; Termination: Gull Wing; Electrical Life: 10000Cycles; Series: EG; RoHS Compliant: Yes; ComponentLink1URL: https://media.digikey.com/pdf/Data%20Sheets/E-Switch%20PDFs/EG1215_Series_Ds.pdf?src-supplier=Digi-Key; ComponentLink1Description: https://media.digikey.com/pdf/Data%20Sheets/E-Switch%20PDFs/EG1215_Series_Ds.pdf?src-supplier=Digi-Key; ComponentLink2URL: http://www.farnell.com/datasheets/2645007.pdf?src-supplier=Farnell; ComponentLink2Description: http://www.farnell.com/datasheets/2645007.pdf?src-supplier=Farnell; Category: Slide Switches
U2 = U_ESP32-WROOM-32E-N4: SMD module, ESP32-D0WD-V3, ESP32 ECO V3, 4 MB SPI flash, PCB antenna; Manufacturer: Espressif Systems; Manufacturer Part Number: ESP32-WROOM-32E(M113EH3200PH3Q0); Designed By: Ahmet Can; Max Supply Voltage: 3.6V; Nominal Supply Voltage: 3.3V; Min Supply Voltage: 3V; Supplier: Digi-Key; Supplier Part Number: 1965-ESP32-WROOM-32E-N4TR-ND; RoHS: No; Category: RF Receivers, Transceivers; Stock: 15684; Pricing: 650=2,94 (USD); Case/Package: 38-SMD Module; Pins: 38; Min Operating Temperature: –40 °C; Max Operating Temperature: 85 °C
U3 = U_STM32F103C6T6A: MCU 32-bit STM32F ARM Cortex M3 RISC 32KB Flash 2.5V/3.3V 48-Pin LQFP Tray; Manufacturer: STMicroelectronics; Number of Timers/Counters: 3; Max Supply Voltage: 3.6V; Interface: I2C,SPI,USART; RAM Size: 10KB; Number of I/Os: 37; Min Supply Voltage: 2V; Data Bus Width: 32b; Clock Frequency: 72MHz; Number of ADC Channels: 10; Designed By: Ahmet Can; Supplier: Digi-Key; Supplier Part Number: 497-11515-ND; Manufacturer Part Number: STM32F103C6T6A; RoHS: Yes; Category: Microcontrollers; Stock: 188; Pricing: 1=6,37, 10=5,723, 25=5,4104, 80=4,689, 250=4,44852, 500=3,99166, 1000=3,36645, 2500=3,19813 (USD); Case/Package: LQFP; Pins: 48; Weight: 0.006409oz; Min Operating Temperature: -40°C; Max Operating Temperature: 85°C; Packaging: Tray; Series: STM32F103C6; Package Quantity: 1500; Memory Format: FLASH; Memory Size: 32KB; Core Architecture: ARM; Length: 7mm; Width: 7mm; Height: 1.4mm; Lead Free: Lead Free; RoHS Compliant: Yes; ComponentLink1URL: https://datasheet.ciiva.com/15122/getdatasheetpartid-69879-15122075.pdf?src-supplier=Verical; ComponentLink1Description: https://datasheet.ciiva.com/15122/getdatasheetpartid-69879-15122075.pdf?src-supplier=Verical; ComponentLink2URL: https://datasheet.ciiva.com/14100/pustm-arm-microcont-stm32f103-en-14100507.pdf?src-supplier=Distrelec; ComponentLink2Description: https://datasheet.ciiva.com/14100/pustm-arm-microcont-stm32f103-en-14100507.pdf?src-supplier=Distrelec
U4 = RTC_M41T0M6F: M41T0 Series 2 to 5.5 V Serial I2C Real Time Clock Surface Mount - SOIC-8; Manufacturer: STMicroelectronics; Max Supply Voltage: 5.5V; Min Supply Voltage: 2V; Interface: I2C,Serial,2-Wire; Memory Size: 8B; Time Format: HH:MM:SS; Date Format: YY-MM-DD-dd; DesignedBy: Ahmet Can; Supplier: Digi-Key; Supplier Part Number: 497-4698-1-ND; Manufacturer Part Number: M41T0M6F; RoHS: Yes; Category: Real Time Clocks; Stock: 30971; Pricing: 1=2,96, 10=2,655, 25=2,51, 100=2,1754, 250=2,06388, 500=1,8519, 1000=1,56185 (USD); Mounting Technology: Surface Mount; Case/Package: SOIC; Pins: 8; Weight: 0.019048oz; Min Operating Temperature: -40°C; Max Operating Temperature: 85°C; Packaging: Tape and Reel; Logic Function: Clock; Series: -; Nominal Supply Voltage: 5.5V; Length: 5mm; Width: 4mm; Height: 1.5mm; Radiation Hardening: No; Lead Free: Lead Free; Temperature Grade: INDUSTRIAL; RoHS Compliant: Yes; ComponentLink1URL: https://datasheet.ciiva.com/4772/cd00003139-81284-4772149.pdf?src-supplier=Mouser; ComponentLink1Description: https://datasheet.ciiva.com/4772/cd00003139-81284-4772149.pdf?src-supplier=Mouser; ComponentLink2URL: https://datasheet.ciiva.com/41459/001185346-da-01-en-ic-rtc-serial-2-5-5v-m41t0m6f-soic-8-stm-41459817.pdf?src-supplier=Conrad; ComponentLink2Description: https://datasheet.ciiva.com/41459/001185346-da-01-en-ic-rtc-serial-2-5-5v-m41t0m6f-soic-8-stm-41459817.pdf?src-supplier=Conrad; ComponentLink3URL: https://datasheet.ciiva.com/15152/getdatasheetpartid-98630-15152779.pdf?src-supplier=Verical; ComponentLink3Description: https://datasheet.ciiva.com/15152/getdatasheetpartid-98630-15152779.pdf?src-supplier=Verical; Non-volatile Memory Size: 8B
U5 = U_MAX6662MSA+: Temp Sensor Digital Serial (3-Wire, SPI) 8-Pin SOIC N Tube; Manufacturer: Maxim; Min Supply Voltage: 3V; Max Supply Voltage: 5.5V; Designed By: Ahmet Can; Resolution: 12 b; Supplier: Digi-Key; Supplier Part Number: MAX6662MSA+-ND; Manufacturer Part Number: MAX6662MSA+; RoHS: Yes; Category: Temperature and Humidity Sensors; Stock: 593; Pricing: 1=4,61, 10=3,454, 25=3,0704, 50=2,9168, 100=2,8401, 500=2,37956, 1000=2,22604 (USD); ComponentLink1URL: https://datasheet.ciiva.com/5299/max6662-89142-5299456.pdf?src-supplier=Mouser; ComponentLink1Description: https://datasheet.ciiva.com/5299/max6662-89142-5299456.pdf?src-supplier=Mouser; ComponentLink2URL: https://datasheet.ciiva.com/2003/max6662-2003390.pdf?src-supplier=Digi-Key; ComponentLink2Description: https://datasheet.ciiva.com/2003/max6662-2003390.pdf?src-supplier=Digi-Key; ComponentLink3URL: https://datasheet.ciiva.com/3277/max6662-3277979.pdf?src-supplier=Avnet; ComponentLink3Description: https://datasheet.ciiva.com/3277/max6662-3277979.pdf?src-supplier=Avnet; Pins: 8; Case/Package: SOIC; Max Operating Temperature: 150°C; Min Operating Temperature: -55°C; Output Type: SPI; Features: Output Switch, Programmable Limit, Shutdown Mode
XTAL1 = XTAL_CRYSTAL 16 MHz: Crystal 16MHz ±30ppm (Tol) ±100ppm (Stability) 20pF FUND 50Ohm 4-Pin SMD T/R; Manufacturer: ECS International; Manufacturer Part Number: ECS-160-20-30B-DU; Designed By: Ahmet Can; ESR: 50 Ohms; Frequency Stability: ±50ppm; Operating Mode: Fundamental; Supplier: Digi-Key; Supplier Part Number: XC1513CT-ND; RoHS: Yes; Category: Crystals; Stock: 31156; Pricing: 1=0,87, 10=0,767, 50=0,7172, 100=0,6338, 500=0,60042 (USD); ComponentLink1URL: https://datasheet.ciiva.com/853/ecx-53b-du-853415.pdf?src-supplier=Digi-Key; ComponentLink1Description: https://datasheet.ciiva.com/853/ecx-53b-du-853415.pdf?src-supplier=Digi-Key; ComponentLink2URL: https://datasheet.ciiva.com/853/ecx-53b-du-853416.pdf?src-supplier=Digi-Key; ComponentLink2Description: https://datasheet.ciiva.com/853/ecx-53b-du-853416.pdf?src-supplier=Digi-Key; ComponentLink3URL: https://datasheet.ciiva.com/853/ecx-53b-du-853417.pdf?src-supplier=Digi-Key; ComponentLink3Description: https://datasheet.ciiva.com/853/ecx-53b-du-853417.pdf?src-supplier=Digi-Key; Max Operating Temperature: 70°C; Frequency Tolerance: ±30ppm; Min Operating Temperature: -20°C; Load Capacitance: 20pF
XTAL2 = XTAL_CRYSTAL 32.768 KHz: CRYSTAL 32.768kHz ±20ppm Crystal 12.5pF 90 kOhm -40°C ^ 85°C Surface Mount 2-SMD; Manufacturer: Abracon; ESR (Equivalent Series Resistance): 90kR; Designed By: Ahmet Can; Supplier: Digi-Key; Supplier Part Number: 535-11899-1-ND; Manufacturer Part Number: ABS05-32.768KHZ-T; RoHS: Yes; Category: Crystals; Stock: 306117; Pricing: 1=0,72, 10=0,603, 50=0,5426, 100=0,4823, 500=0,4582, 1000=0,38586 (USD); Mounting Technology: Surface Mount; Case/Package: CSMD; Pins: 2; Min Operating Temperature: -40°C; Max Operating Temperature: 85°C; Packaging: Tape and Reel; Frequency Tolerance: 20ppm; Load Capacitance: 12.5pF; Package Quantity: 3000; Tolerance: 20ppm; Termination: SMD/SMT; ESR: 90kR; Series: ABS05; Operating Frequency: 32.768 kHz; Length: 1.6mm; Width: 1mm; Height: 0.5mm; Depth: 1mm; Radiation Hardening: No; Reach SVHC Compliant: No; Lead Free: Lead Free; RoHS Compliant: Yes; ComponentLink1URL: https://datasheet.ciiva.com/23810/abs05-23810480.pdf?src-supplier=Newark; ComponentLink1Description: https://datasheet.ciiva.com/23810/abs05-23810480.pdf?src-supplier=Newark; ComponentLink2URL: https://datasheet.ciiva.com/6728/abs05-6728949.pdf?src-supplier=Digi-Key; ComponentLink2Description: https://datasheet.ciiva.com/6728/abs05-6728949.pdf?src-supplier=Digi-Key; ComponentLink3URL: https://datasheet.ciiva.com/6728/abs05-6728950.pdf?src-supplier=Digi-Key; ComponentLink3Description: https://datasheet.ciiva.com/6728/abs05-6728950.pdf?src-supplier=Digi-Key; ComponentLink4URL: https://datasheet.ciiva.com/16411/abs05-16411149.pdf?src-supplier=Future+Electronics; ComponentLink4Description: https://datasheet.ciiva.com/16411/abs05-16411149.pdf?src-supplier=Future+Electronics